# EAGLE design EasyRider (EAGLE 6.3)
EasyRider Motorcycle Telemetrics REV A
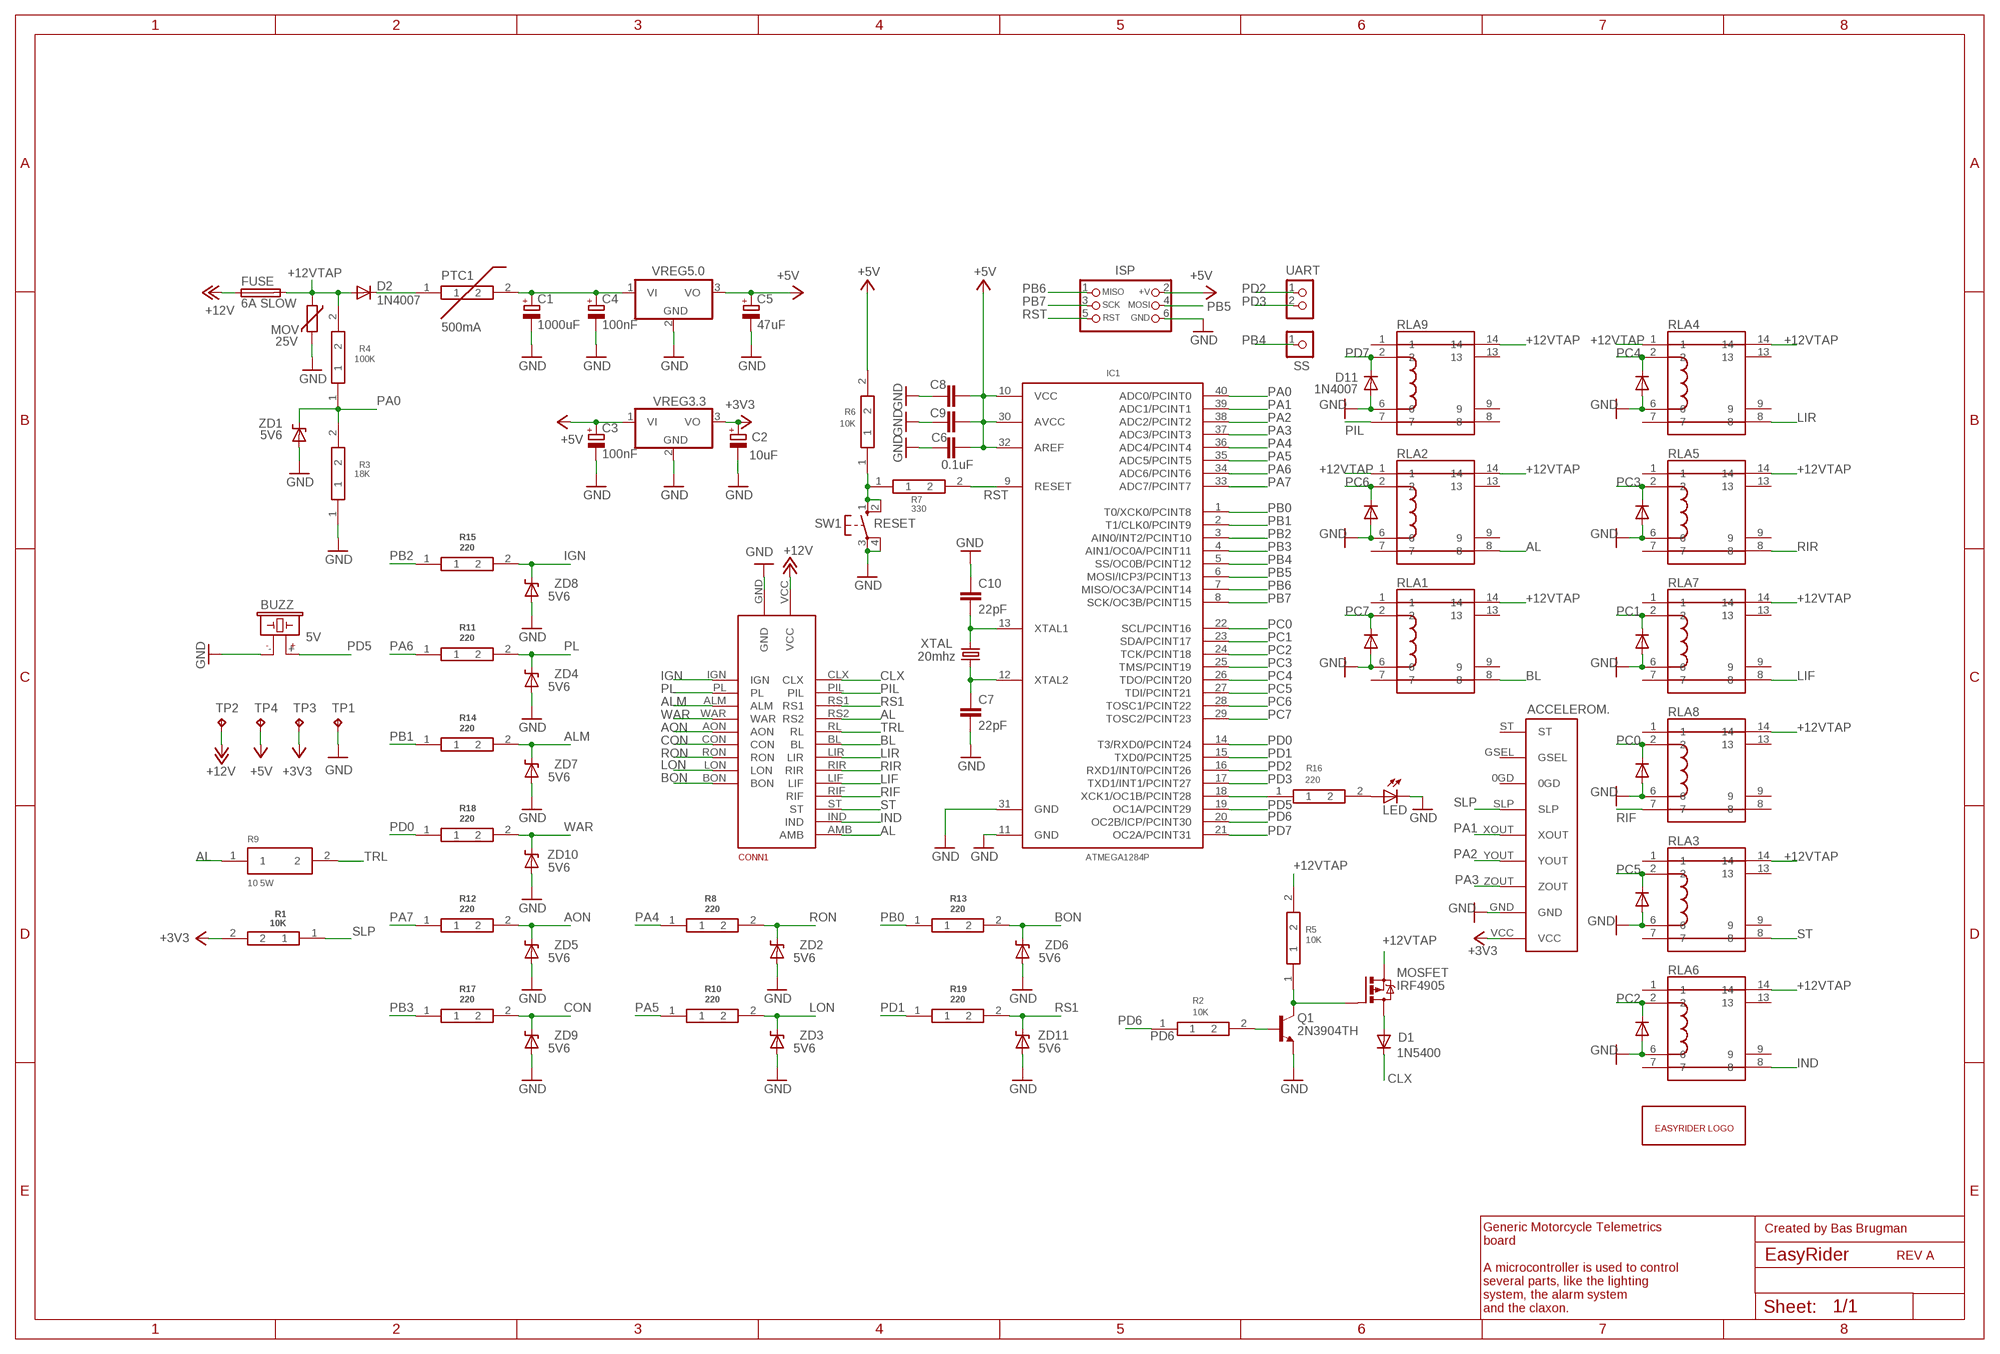
[diagram p0: schematic, sheet 1]

## Parts
ACCELEROM.  MMA7361FREESCALE  ACCELBOARDSIL  [BREAKOUT]
BUZZ  5V  BUZZERDIP  [0.3PITCH]
C1  1000uF  CAPACITOR_POL0.2PITCH  [E5-10,5]
C2  10uF  CAPACITOR_POL0.1PITCH4MMDIA  [E2,5-4R]
C3  100nF  CAPACITOR_POL0.1PITCH4MMDIA  [E2,5-4R]
C4  100nF  CAPACITOR_POL0.1PITCH4MMDIA  [E2,5-4R]
C5  47uF  CAPACITOR_POL0.1PITCH  [E2,5-7]
C6  0.1uF  CAPACITOR0.1PITCH  [C025-024X044]
C7  22pF  CAPACITOR0.1PITCH  [C025-024X044]
C8  0.1uF  CAPACITOR0.1PITCH  [C025-024X044]
C9  0.1uF  CAPACITOR0.1PITCH  [C025-024X044]
C10  22pF  CAPACITOR0.1PITCH  [C025-024X044]
CONN1  EASYRIDER_CONNDIP  [SIL]
D1  1N5400  1N5400DIP  [DO201-15]
D2  1N4007  1N4007DIP  [DIP_1N4007]
D3  1N4007DIP  [DIP_1N4007]
D4  1N4007DIP  [DIP_1N4007]
D5  1N4007DIP  [DIP_1N4007]
D6  1N4007DIP  [DIP_1N4007]
D7  1N4007DIP  [DIP_1N4007]
D8  1N4007DIP  [DIP_1N4007]
D9  1N4007DIP  [DIP_1N4007]
D10  1N4007DIP  [DIP_1N4007]
D11  1N4007  1N4007DIP  [DIP_1N4007]
FUSE  6A SLOW  FUSE_HOLDER_225DIP  [SH22,5A]
IC1  ATMEGA1284P  MEGA1284PDIP  [DIL40]
ISP  CON_HEADER_PRG_AVR_ICSP-PTH  [HEADER_PRG_2X03]
LED  LEDDIP  [LED3MM]
MOSFET  IRF4905  IRF4905TH  [TO220]
MOV  25V  VARISTORSIL  [R-5]
PTC1  500mA  PTCSMD  [PTC]
Q1  2N3904TH  [TO92]
R1  10K  RESISTOR_GENERICDIP  [RESISTOR]
R2  10K  RESISTOR_GENERICDIP  [RESISTOR]
R3  18K  RESISTOR_GENERICDIP  [RESISTOR]
R4  100K  RESISTOR_GENERICDIP  [RESISTOR]
R5  10K  RESISTOR_GENERICDIP  [RESISTOR]
R6  10K  RESISTOR_GENERICDIP  [RESISTOR]
R7  330  RESISTOR_GENERICDIP  [RESISTOR]
R8  220  RESISTOR_GENERICDIP  [RESISTOR]
R9  10 5W  RESISTOR_GENERIC_HIGH_WATTDIP  [RESISTOR]
R10  220  RESISTOR_GENERICDIP  [RESISTOR]
R11  220  RESISTOR_GENERICDIP  [RESISTOR]
R12  220  RESISTOR_GENERICDIP  [RESISTOR]
R13  220  RESISTOR_GENERICDIP  [RESISTOR]
R14  220  RESISTOR_GENERICDIP  [RESISTOR]
R15  220  RESISTOR_GENERICDIP  [RESISTOR]
R16  220  RESISTOR_GENERICDIP  [RESISTOR]
R17  220  RESISTOR_GENERICDIP  [RESISTOR]
R18  220  RESISTOR_GENERICDIP  [RESISTOR]
R19  220  RESISTOR_GENERICDIP  [RESISTOR]
RLA1  MEDER_REED_DIP05-1A72-12LDIP  [DIP05-1A72-12L]
RLA2  MEDER_REED_DIP05-1A72-12LDIP  [DIP05-1A72-12L]
RLA3  MEDER_REED_DIP05-1A72-12LDIP  [DIP05-1A72-12L]
RLA4  MEDER_REED_DIP05-1A72-12LDIP  [DIP05-1A72-12L]
RLA5  MEDER_REED_DIP05-1A72-12LDIP  [DIP05-1A72-12L]
RLA6  MEDER_REED_DIP05-1A72-12LDIP  [DIP05-1A72-12L]
RLA7  MEDER_REED_DIP05-1A72-12LDIP  [DIP05-1A72-12L]
RLA8  MEDER_REED_DIP05-1A72-12LDIP  [DIP05-1A72-12L]
RLA9  MEDER_REED_DIP05-1A72-12LDIP  [DIP05-1A72-12L]
SS  CON_HEADER_1X01-PTH  [M1X1]
SW1  RESET  10-XXDIP  [DIP45MM_56MM_PITCH]
TP1  TPTP20SQ  [TP20SQ]
TP2  TPTP20SQ  [TP20SQ]
TP3  TPTP20SQ  [TP20SQ]
TP4  TPTP20SQ  [TP20SQ]
U$1  EASYRIDER_LOGO  [EASYRIDER_LOGO]
UART  CON_HEADER_1X02-PTH  [M1X2]
VREG3.3  VREG_IGODIP  [TO220]
VREG5.0  VREG_IGODIP  [TO220]
XTAL  20mhz  CRYSTALDIP  [HC49/S]
ZD1  5V6  DIODE_ZENER_56DIP  [DIODE_ZENER_56]
ZD2  5V6  DIODE_ZENER_56DIP  [DIODE_ZENER_56]
ZD3  5V6  DIODE_ZENER_56DIP  [DIODE_ZENER_56]
ZD4  5V6  DIODE_ZENER_56DIP  [DIODE_ZENER_56]
ZD5  5V6  DIODE_ZENER_56DIP  [DIODE_ZENER_56]
ZD6  5V6  DIODE_ZENER_56DIP  [DIODE_ZENER_56]
ZD7  5V6  DIODE_ZENER_56DIP  [DIODE_ZENER_56]
ZD8  5V6  DIODE_ZENER_56DIP  [DIODE_ZENER_56]
ZD9  5V6  DIODE_ZENER_56DIP  [DIODE_ZENER_56]
ZD10  5V6  DIODE_ZENER_56DIP  [DIODE_ZENER_56]
ZD11  5V6  DIODE_ZENER_56DIP  [DIODE_ZENER_56]

## Nets
+3V3: ACCELEROM..VCC C2.+ R1.2 TP3.TP VREG3.3.3(VO)
+5V: C3.+ C5.+ C6.2 C8.2 C9.2 IC1.10(VCC) IC1.30(AVCC) IC1.32(AREF) ISP.2(+V) R6.2 TP4.TP VREG3.3.1(VI) VREG5.0.3(VO)
+12V [20mil_clearance]: CONN1.VCC FUSE.1 TP2.TP
+12VTAP [12mil_clearance]: D2.A FUSE.2 MOSFET.S MOV.1 R4.2 R5.2 RLA1.14 RLA2.1 RLA2.14 RLA3.14 RLA4.1 RLA4.14 RLA5.14 RLA6.14 RLA7.14 RLA8.14 RLA9.14
AL: CONN1.AMB CONN1.RS2 R9.1 RLA2.8
ALM: CONN1.ALM R14.2 ZD7.C
AON: CONN1.AON R12.2 ZD5.C
BL: CONN1.BL RLA1.8
BON: CONN1.BON R13.2 ZD6.C
CLX [20mil_clearance]: CONN1.CLX D1.C
CON: CONN1.CON R17.2 ZD9.C
GND: ACCELEROM..GND BUZZ.- C1.- C2.- C3.- C4.- C5.- C6.1 C7.2 C8.1 C9.1 C10.1 CONN1.GND D3.A D4.A D5.A D6.A D7.A D8.A D9.A D10.A D11.A IC1.11(GND) IC1.31(GND) ISP.6(GND) LED.K(C) MOV.2 Q1.3(E) R3.1 RLA1.6 RLA2.6 RLA3.6 RLA4.6 RLA5.6 RLA6.6 RLA7.6 RLA8.6 RLA9.6 SW1.3 SW1.4 TP1.TP VREG3.3.2(GND) VREG5.0.2(GND) ZD1.A ZD2.A ZD3.A ZD4.A ZD5.A ZD6.A ZD7.A ZD8.A ZD9.A ZD10.A ZD11.A
IGN: CONN1.IGN R15.2 ZD8.C
IND: CONN1.IND RLA6.8
LIF: CONN1.LIF RLA7.8
LIR: CONN1.LIR RLA4.8
LON: CONN1.LON R10.2 ZD3.C
N$1: C7.1 IC1.12(XTAL2) XTAL.1
N$2: C10.2 IC1.13(XTAL1) XTAL.2
N$4: R6.1 R7.1 SW1.1 SW1.2
N$5: IC1.18(XCK1/OC1B/PCINT28) R16.1
N$6: MOSFET.G Q1.1(C) R5.1
N$7 [20mil_clearance]: D1.A MOSFET.D
N$8: LED.A R16.2
N$25 [20mil_clearance]: C1.+ C4.+ PTC1.2 VREG5.0.1(VI)
N$26 [20mil_clearance]: D2.C PTC1.1
N$30: Q1.2(B) R2.2
PA0: IC1.40(ADC0/PCINT0) R3.2 R4.1 ZD1.C
PA1: ACCELEROM..XOUT IC1.39(ADC1/PCINT1)
PA2: ACCELEROM..YOUT IC1.38(ADC2/PCINT2)
PA3: ACCELEROM..ZOUT IC1.37(ADC3/PCINT3)
PA4: IC1.36(ADC4/PCINT4) R8.1
PA5: IC1.35(ADC5/PCINT5) R10.1
PA6: IC1.34(ADC6/PCINT6) R11.1
PA7: IC1.33(ADC7/PCINT7) R12.1
PB0: IC1.1(T0/XCK0/PCINT8) R13.1
PB1: IC1.2(T1/CLK0/PCINT9) R14.1
PB2: IC1.3(AIN0/INT2/PCINT10) R15.1
PB3: IC1.4(AIN1/OC0A/PCINT11) R17.1
PB4: IC1.5(SS/OC0B/PCINT12) SS.1
PB5: IC1.6(MOSI/ICP3/PCINT13) ISP.4(MOSI)
PB6: IC1.7(MISO/OC3A/PCINT14) ISP.1(MISO)
PB7: IC1.8(SCK/OC3B/PCINT15) ISP.3(SCK)
PC0: D10.C IC1.22(SCL/PCINT16) RLA8.2
PC1: D9.C IC1.23(SDA/PCINT17) RLA7.2
PC2: D8.C IC1.24(TCK/PCINT18) RLA6.2
PC3: D7.C IC1.25(TMS/PCINT19) RLA5.2
PC4: D6.C IC1.26(TDO/PCINT20) RLA4.2
PC5: D5.C IC1.27(TDI/PCINT21) RLA3.2
PC6: D4.C IC1.28(TOSC1/PCINT22) RLA2.2
PC7: D3.C IC1.29(TOSC2/PCINT23) RLA1.2
PD0: IC1.14(T3/RXD0/PCINT24) R18.1
PD1: IC1.15(TXD0/PCINT25) R19.1
PD2: IC1.16(RXD1/INT0/PCINT26) UART.1
PD3: IC1.17(TXD1/INT1/PCINT27) UART.2
PD5: BUZZ.+ IC1.19(OC1A/PCINT29)
PD6: IC1.20(OC2B/ICP/PCINT30) R2.1
PD7: D11.C IC1.21(OC2A/PCINT31) RLA9.2
PIL: CONN1.PIL RLA9.7
PL: CONN1.PL R11.2 ZD4.C
RIF: CONN1.RIF RLA8.7
RIR: CONN1.RIR RLA5.8
RON: CONN1.RON R8.2 ZD2.C
RS1: CONN1.RS1 R19.2 ZD11.C
RST: IC1.9(RESET) ISP.5(RST) R7.2
SLP: ACCELEROM..SLP R1.1
ST: CONN1.ST RLA3.8
TRL: CONN1.RL R9.2
WAR: CONN1.WAR R18.2 ZD10.C
Unconnected: ACCELEROM..0GD ACCELEROM..GSEL ACCELEROM..ST RLA1.1 RLA1.7 RLA1.9 RLA1.13 RLA2.7 RLA2.9 RLA2.13 RLA3.1 RLA3.7 RLA3.9 RLA3.13 RLA4.7 RLA4.9 RLA4.13 RLA5.1 RLA5.7 RLA5.9 RLA5.13 RLA6.1 RLA6.7 RLA6.9 RLA6.13 RLA7.1 RLA7.7 RLA7.9 RLA7.13 RLA8.1 RLA8.8 RLA8.9 RLA8.13 RLA9.1 RLA9.8 RLA9.9 RLA9.13

## Notes on the sheet
- Created by Bas Brugman
- REV A
- Generic Motorcycle Telemetrics
  board
  
  A microcontroller is used to control
  several parts, like the lighting
  system, the alarm system
  and the claxon.

## Library data of the parts
ACCELEROM. = accelboar_mma7361:ACCELBOARD
BUZZ = buzzer:BUZZER: Generic buzzer; OC_FARNELL: unknown; OC_NEWARK: unknown
C1-C5 = cap_pol:CAPACITOR_POL
C6-C10 = cap_ceramic:CAPACITOR
CONN1 = connector_easyrider:EASYRIDER_CONN
D1 = diode_1n5400:1N5400: DIODE standard rectifier, 3 A, 50 V (Motorola)
D2-D11 = diode_1n4007:1N4007: DIODE general purpose rectifier, 1 A
FUSE = fuseholder_5x20_225:FUSE_HOLDER_225: FUSE HOLDER grid 22,5mm, isolated cap OGN0031 8201, Schurter (Buerklin); MPN: 0031.7701.11; OC_FARNELL: unknown; OC_NEWARK: 04F1224
IC1 = atmel_avr_atmega1284p:MEGA1284P: Atmel ATmega1284P 8-bit AVR Microcontroller
ISP = isp_header:CON_HEADER_PRG_AVR_ICSP: 2x3 AVR ICSP programming header
LED = led:LED
MOSFET = mosfet_pnp:IRF4905: P-Channel HEXFET® Power MOSFET RDS(on)= 0.02 Ohm, ID = -74A Source: http://www.irf.com/product-info/datasheets/data/irf4905pbf.pdf
MOV = varistor:VARISTOR: 5mm pitch TH varistor
PTC1 = ptc_fuse_smd:PTC: PTC resettable fuse 500mA for 3.2mmx1.5mm package
Q1 = transistor_npn:2N3904: NPN Transistor
R1-R8 R10-R19 = resistor_generic_dip:RESISTOR_GENERIC
R9 = resistor_highwatt_dip:RESISTOR_GENERIC_HIGH_WATT: High watt cement resistor
RLA1-RLA9 = meder_reed_DIP05-1A72-12L:MEDER_REED_DIP05-1A72-12L: Meder Reed relay ic package 5V on coil, switching 15 watt
SS = connector_single:CON_HEADER_1X01
SW1 = button_momentary_6mm:10-XX: generic momentary button; MPN: B3F-1000; OC_FARNELL: 176432; OC_NEWARK: 36M3542
TP1-TP4 = testpad:TP: Test pad
U$1 = easyrider_logo:EASYRIDER_LOGO
UART = uart_header:CON_HEADER_1X02
VREG3.3 VREG5.0 = voltagereg_igo:VREG_IGO: Generic TO220 package for horizontal placed voltage regulators.
XTAL = crystal:CRYSTAL
ZD1-ZD11 = diode_zener_V56:DIODE_ZENER_56: Z DIODE 1.3 W

## Net classes
1 20mil_clearance: clearance 0.508 mm
2 12mil_clearance: clearance 0.305 mm

## Board
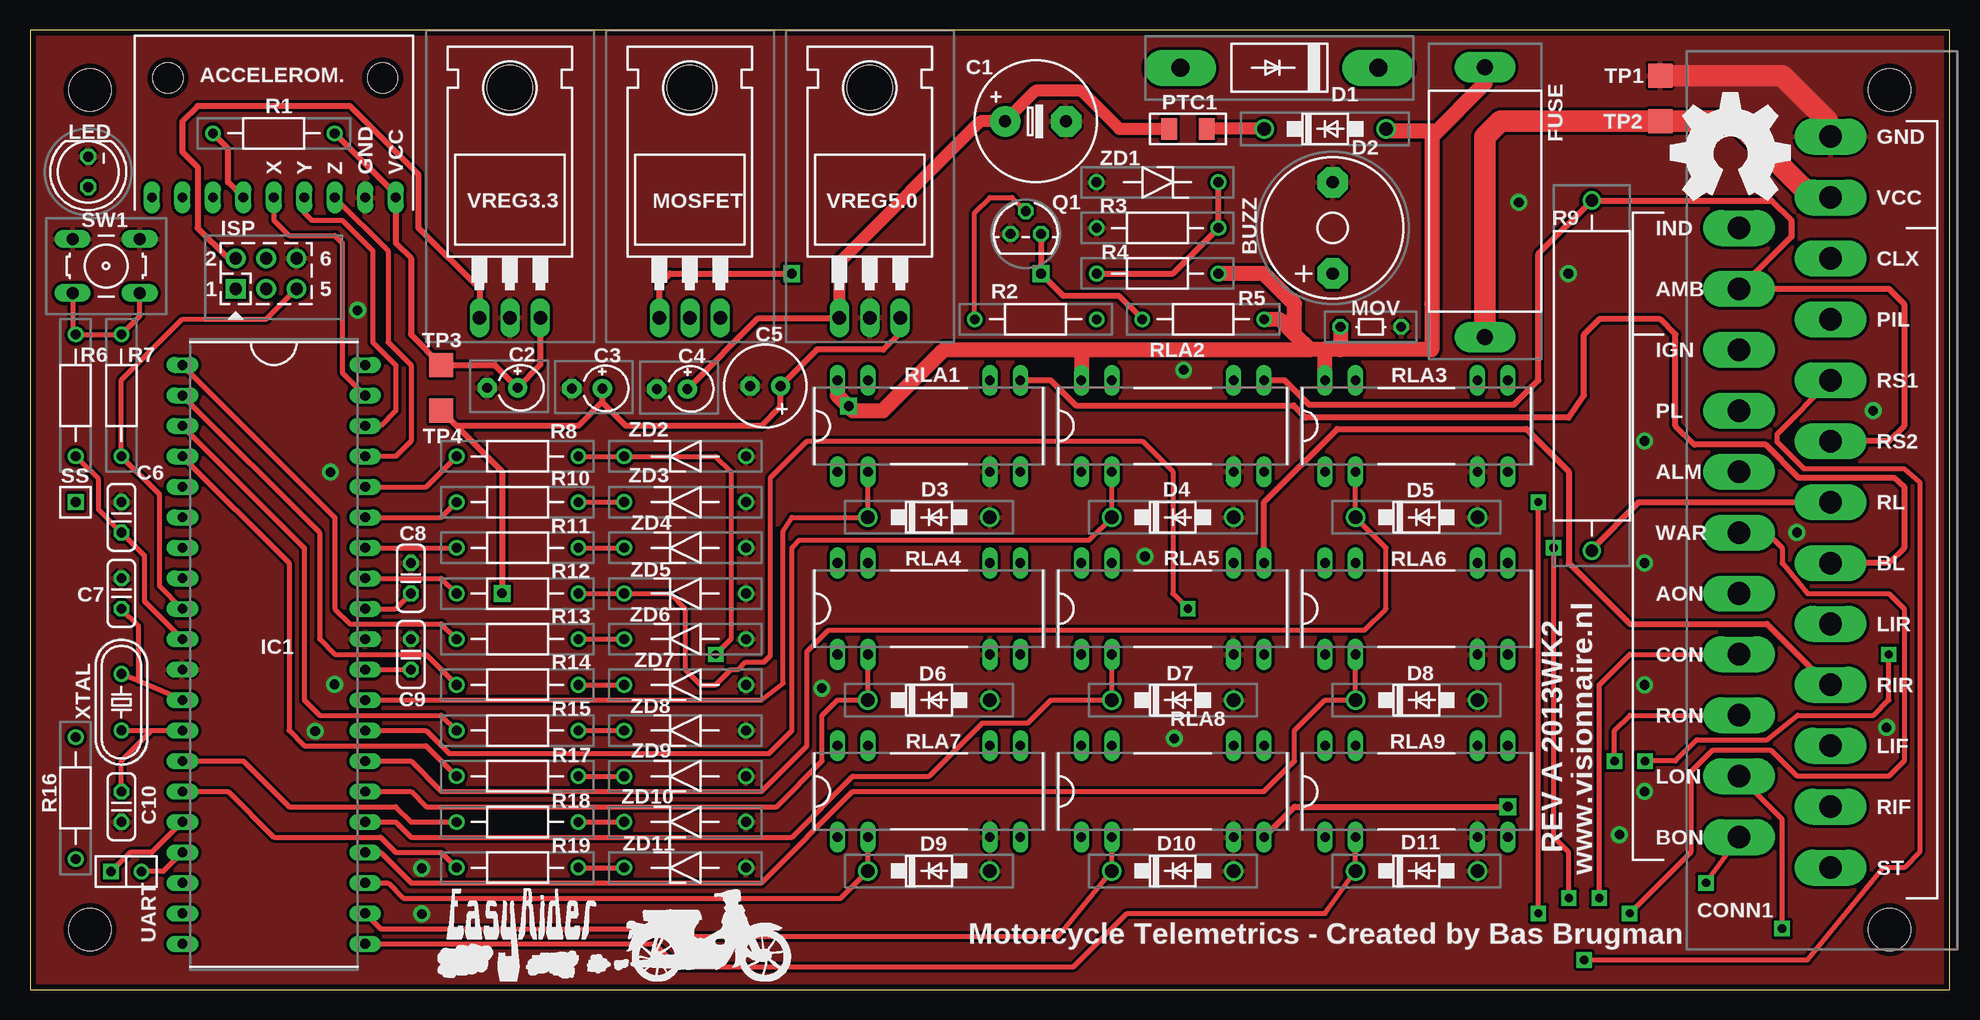
[diagram p1: board, top side]
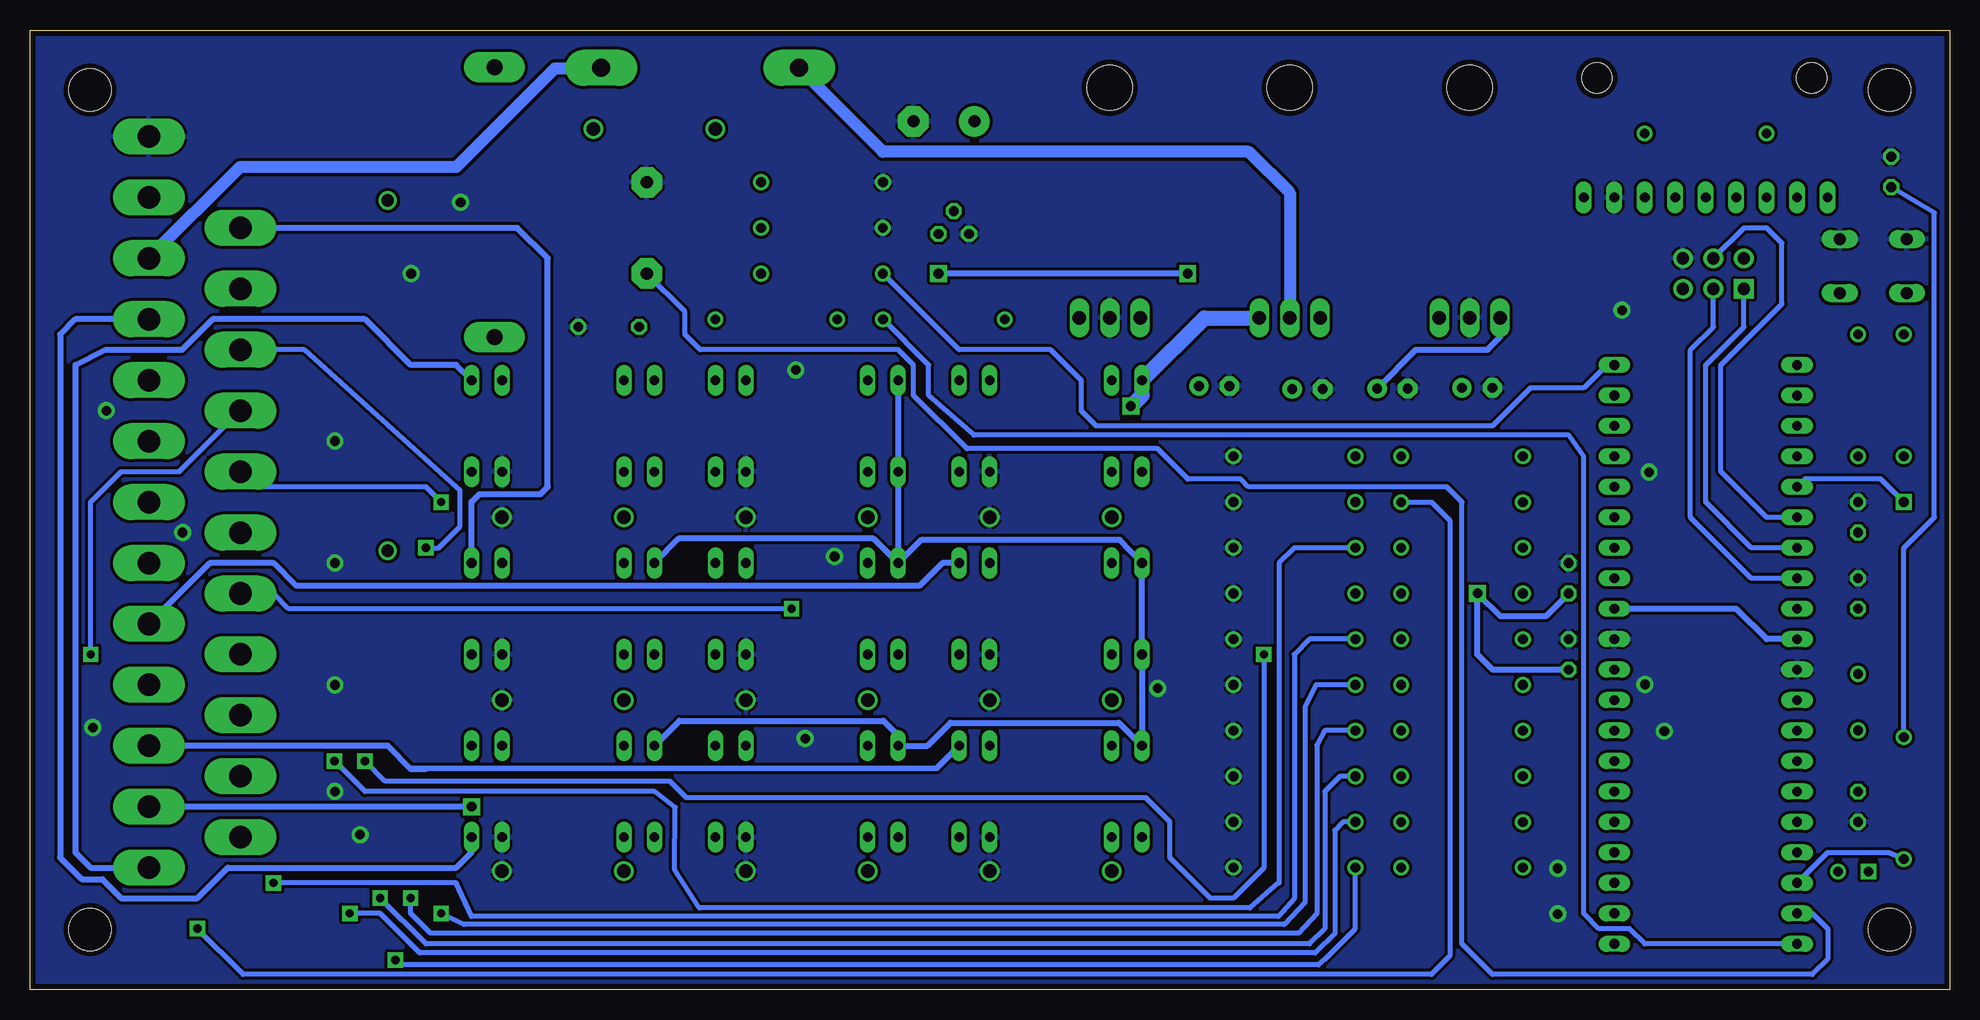
[diagram p2: board, bottom side, seen from below]

Size 160 x 80 mm. Coordinates in mm from the lower left corner, seen from the top.
Outline: 0,0 160,0 160,80 0,80 0,0
Copper layers (1*16): Top 0.018mm / dielectric 1.55mm / Bottom 0.018mm
Design rules "eC-STANDARD_pool-2-layer  *": minimum track width 0.15mm, minimum drill 0.25mm, track to track 10mil, track to pad 10mil, pad to pad 10mil, via to via 10mil, smd to smd 10mil, copper to edge 0.45mm, drill to drill 0.3mm, minimum pad ring 0.25mm, minimum via ring 0.3mm, stop-mask expansion 0.1mm, vias tented up to drill 0mil, thermal gap 0.2mm
Holes 3.5 mm at 5,5 5,75 155,75 155,5
Holes 2.5 mm at 29.4,76 11.5,76

### Footprints (pad centres in the part's own frame; a part is rotated, then mirrored left to right if it is on the bottom)
BREAKOUT = drill 0.813 long: 0GD 0,5.08; GND 0,-7.62; GSEL 0,7.62; SLP 0,2.54; ST 0,10.16; VCC 0,-10.16; XOUT 0,0; YOUT 0,-2.54; ZOUT 0,-5.08
0.3PITCH = drill 1.016 pad 2.54 octagon: + -3.81,0; - 3.81,0
E5-10,5 = drill 1.016 pad 2.54: + -2.54,0 | drill 1.016 pad 2.54 octagon: - 2.54,0
E2,5-4R = drill 0.813 pad 1.6: + -1.27,0 | drill 0.813 pad 1.6 octagon: - 1.27,0
E2,5-7 = drill 0.813 pad 1.6: + -1.27,0 | drill 0.813 pad 1.6 octagon: - 1.27,0
C025-024X044 = drill 0.813 octagon: 1 -1.27,0; 2 1.27,0
SIL = drill 1.88 pad 3 long: ALM -7.62,33.02; AMB -7.62,48.26; AON -7.62,22.86; BL 0,25.4; BON -7.62,2.54; CLX 0,50.8; CON -7.62,17.78; GND 0,60.96; IGN -7.62,43.18; IND -7.62,53.34; LIF 0,10.16; LIR 0,20.32; LON -7.62,7.62; PIL 0,45.72; PL -7.62,38.1; RIF 0,5.08; RIR 0,15.24; RL 0,30.48; RON -7.62,12.7; RS1 0,40.64; RS2 0,35.56; ST 0,0; VCC 0,55.88; WAR -7.62,27.94
DO201-15 = drill 1.499 pad 3 long: A -8.25,0; C 8.25,0
DIP_1N4007 = drill 1.118: A -5.08,0; C 5.08,0
SH22,5A = drill 1.321 pad 2.54 long: 1 -11,0; 2 11.5,0
DIL40 = drill 0.813 long: 1 -24.13,-7.62; 2 -21.59,-7.62; 3 -19.05,-7.62; 4 -16.51,-7.62; 5 -13.97,-7.62; 6 -11.43,-7.62; 7 -8.89,-7.62; 8 -6.35,-7.62; 9 -3.81,-7.62; 10 -1.27,-7.62; 11 1.27,-7.62; 12 3.81,-7.62; 13 6.35,-7.62; 14 8.89,-7.62; 15 11.43,-7.62; 16 13.97,-7.62; 17 16.51,-7.62; 18 19.05,-7.62; 19 21.59,-7.62; 20 24.13,-7.62; 21 24.13,7.62; 22 21.59,7.62; 23 19.05,7.62; 24 16.51,7.62; 25 13.97,7.62; 26 11.43,7.62; 27 8.89,7.62; 28 6.35,7.62; 29 3.81,7.62; 30 1.27,7.62; 31 -1.27,7.62; 32 -3.81,7.62; 33 -6.35,7.62; 34 -8.89,7.62; 35 -11.43,7.62; 36 -13.97,7.62; 37 -16.51,7.62; 38 -19.05,7.62; 39 -21.59,7.62; 40 -24.13,7.62
HEADER_PRG_2X03 = drill 1.02 pad 1.632 square: 1 -2.54,-1.27 | drill 1.02 pad 1.632: 2 -2.54,1.27; 3 0,-1.27; 4 0,1.27; 5 2.54,-1.27; 6 2.54,1.27
LED3MM = drill 0.813 octagon: A -1.27,0; K 1.27,0
TO220 = drill 1.118 long: D 0,-7.985; G -2.54,-7.985; S 2.54,-7.985 | hole 3.75: 0,11.176
R-5 = drill 0.813 octagon: 1 -2.54,0; 2 2.54,0
PTC = smd 1.3 x 1.8: 1 -1.55,0; 2 1.55,0
TO92 = drill 0.813 octagon: 1 1.27,0; 2 0,1.905; 3 -1.27,0
RESISTOR = drill 0.8: 1 -5.08,0; 2 5.08,0
RESISTOR' = drill 1.016: 1 -12.7,0; 2 16.51,0
DIP05-1A72-12L = drill 0.8 long: 1 -7.62,-3.81; 2 -5.08,-3.81; 6 5.08,-3.81; 7 7.62,-3.81; 8 7.62,3.81; 9 5.08,3.81; 13 -5.08,3.81; 14 -7.62,3.81
M1X1 = drill 0.813 square: 1 0,0
DIP45MM_56MM_PITCH = drill 1.016 long: 1 -2.8,2.25; 2 2.8,2.25; 3 -2.8,-2.25; 4 2.8,-2.25
TP20SQ = smd 2 x 2: TP 0,0
M1X2 = drill 0.8 square: 1 -1.27,0 | drill 0.8: 2 1.27,0
TO220' = drill 1.118 long: 1 -2.54,-7.985; 2 0,-7.985; 3 2.54,-7.985 | hole 3.75: 0,11.176
HC49/S = drill 0.813: 1 -2.36,0; 2 2.36,0
DIODE_ZENER_56 = drill 0.813: A -5.08,0; C 5.08,0

### Placement (x,y rotation side)
ACCELEROM.  20.32,66.04 90 top
BUZZ  108.58,63.5 90 top
C1  83.82,72.39 0 top
C2  39.37,50.16 180 top
C3  46.44,50.11 180 top
C4  53.53,50.07 180 top
C5  61.29,50.32 180 top
C6  7.62,39.37 270 top
C7  7.62,33.02 90 top
C8  31.75,34.29 270 top
C9  31.75,27.94 270 top
C10  7.62,15.24 90 top
CONN1  150.09,10.16 0 top
D1  104.14,76.83 0 top
D2  107.95,71.75 180 top
D3  74.93,39.37 180 top
D4  95.25,39.37 180 top
D5  115.57,39.37 180 top
D6  74.93,24.13 180 top
D7  95.25,24.13 180 top
D8  115.57,24.13 180 top
D9  74.93,9.89 180 top
D10  95.25,9.89 180 top
D11  115.57,9.89 180 top
FUSE  121.28,65.41 90 top
IC1  20.32,27.94 270 top
ISP  19.68,59.69 0 top
LED  4.86,68.17 90 top
MOSFET  55,64 0 top
MOV  111.76,55.24 0 top
PTC1  96.52,71.75 180 top
Q1  83,63 0 top
R1  20.32,71.39 0 top
R2  83.82,55.88 180 top
R3  93.98,63.5 0 top
R4  93.98,59.69 0 top
R5  97.79,55.88 0 top
R6  3.81,49.53 270 top
R7  7.62,49.53 270 top
R8  40.64,44.45 0 top
R9  10 5W  [RESISTOR']  130.18,53.09 270 top
R10  40.64,40.64 0 top
R11  40.64,36.83 0 top
R12  40.64,33.02 0 top
R13  40.64,29.21 0 top
R14  40.64,25.4 0 top
R15  40.64,21.59 0 top
R16  3.81,15.97 90 top
R17  40.64,17.78 0 top
R18  40.64,13.97 0 top
R19  40.64,10.16 0 top
RLA1  74.93,46.99 0 top
RLA2  95.25,46.99 0 top
RLA3  115.57,46.99 0 top
RLA4  74.93,31.75 0 top
RLA5  95.25,31.75 0 top
RLA6  115.57,31.75 0 top
RLA7  74.93,16.51 0 top
RLA8  95.25,16.51 0 top
RLA9  115.57,16.51 0 top
SS  3.81,40.64 0 top
SW1  6.35,60.33 180 top
TP1  135.89,76.2 0 top
TP2  135.89,72.39 0 top
TP3  34.29,52.07 0 top
TP4  34.29,48.26 0 top
U$1  33.08,0.64 0 top
U$2  [OSHW_FILLX350_NOTEXT]  136.79,65.85 0 top
UART  8.03,9.84 0 top
VREG3.3  [TO220']  40,64 0 top
VREG5.0  [TO220']  70,64 0 top
XTAL  7.62,23.96 270 top
ZD1  93.98,67.31 0 top
ZD2  54.61,44.45 180 top
ZD3  54.61,40.64 180 top
ZD4  54.61,36.83 180 top
ZD5  54.61,33.02 180 top
ZD6  54.61,29.21 180 top
ZD7  54.61,25.4 180 top
ZD8  54.61,21.59 180 top
ZD9  54.61,17.78 180 top
ZD10  54.61,13.97 180 top
ZD11  54.61,10.16 180 top

### Tracks (layer width: path | path; a pad name or v marks a point on that pad's centre or on a via)
+3V3
  Top 0.508: R1.2 30.48,66.31 ACCELEROM..VCC 30.48,62.23 31.75,60.96 31.75,54.61 TP3.TP 38.73,52.07 C2.+ 42.54,52.06 VREG3.3.3
+5V  (via drill 0.81)
  Top 0.406: IC1.10 9.53,32.38 9.53,36.2 C6.2 5.71,40.01 5.71,42.55 R6.2 | IC1.30 C9.2 | IC1.32 30.48,31.75 C8.2
  Top 0.508: 35.56,46.99 45.72,46.99 47.71,48.98 | 35.56,46.99 TP4.TP | ISP.2 16.51,60.96 13.97,63.5 13.97,68.58 12.7,69.85 12.7,72.39 13.97,73.66 26.67,73.66 32.38,67.94 32.38,63.5 37.47,58.42 VREG3.3.1 | 35.56,46.99 39.37,43.18 v39.34,33.04 | C3.+ 47.71,48.98 | 47.71,48.98 49.69,46.99 60.96,46.99 62.58,48.61 62.58,50.3 C5.+ 65.53,53.29 65.53,53.34 71.12,53.34 72.64,54.86 72.64,55.91 VREG5.0.3
  Bottom 0.508: C8.2 33.66,31.11 37.41,31.11 v39.34,33.04 39.37,33.01 39.37,27.94 38.1,26.67 C9.2 | IC1.10 15.24,29.21 17.78,31.75 IC1.32 | VREG3.3.1 37.46,54.4 38.52,53.34 44.48,53.34 C3.+
+12V
  Top 1.778: CONN1.VCC 148.59,66.04 142.24,72.39 TP2.TP 122.56,72.39 121.28,71.12 FUSE.1
+12VTAP  (via drill 0.81)
  Top 1.27: 116.85,71.12 116.85,71.58 113.21,71.58 D2.A | 116.85,71.12 116.84,57.15 116.84,53.34 109.22,53.34 | 109.22,53.34 107.95,53.34 | 107.95,53.34 106.68,53.34 | 106.68,53.34 105.41,54.61 | 105.41,54.61 105.41,57.15 102.87,59.69 R4.2 | RLA3.14 107.95,53.34 | R5.2 104.14,55.88 105.41,54.61 | RLA1.14 67.31,49.53 68.58,48.26 71.12,48.26 76.2,53.34 87.63,53.34 | FUSE.2 121.28,75.55 116.85,71.12 | MOV.1 109.22,53.34 | 87.63,53.34 106.68,53.34 | 87.63,53.34 RLA2.14
  Bottom 0.508: RLA5.14 87.66,35.56 89.69,37.59 105.92,37.59 RLA6.14 | RLA9.14 105.86,22.41 88.86,22.41 87.63,21.18 RLA8.14 85.21,20.32 83.28,22.24 69.23,22.24 RLA7.14 RLA4.1 RLA4.14 69.19,37.52 85.67,37.52 RLA5.14 | RLA2.14 RLA2.1 RLA5.14
  Bottom 0.762: 57.55,56 MOSFET.S
  Bottom 1.27: 57.55,56 62.11,56 RLA1.14 67.31,49.53 68.2,48.64 v68.25,48.64
AL
  Top 0.508: RLA2.8 104.57,50.8 106.61,48.76 123.69,48.76 125.73,50.8 125.73,61.34 R9.1 145.16,65.79 146.82,64.13 146.82,62.76 CONN1.AMB 154.94,58.42 156.21,57.15 156.21,46.99 154.94,45.72 CONN1.RS2
ALM  (via drill 0.69)
  Top 0.406: R14.2 ZD7.C | v125.73,6.35 v125.73,40.64
  Bottom 0.406: ZD7.C 52.79,25.4 53.72,23.51 53.72,7.27 55.45,5.44 123.85,5.44 v125.73,6.35 | v125.73,40.64 127,41.91 141.21,41.91 CONN1.ALM
AON  (via drill 0.69)
  Top 0.406: R12.2 ZD5.C 53.34,33.02 54.61,31.75 54.61,26.67 55.88,25.4 57.15,25.4 58.42,26.67 59.04,26.67 59.67,27.29 61.18,27.29 61.73,27.84 61.73,42.68 64.77,45.72 92.71,45.72 95.25,43.18 95.25,33.02 v96.52,31.75
  Bottom 0.406: v96.52,31.75 138.43,31.75 139.7,33.02 CONN1.AON
BL
  Top 0.508: RLA1.8 85.07,50.8 87.18,48.69 105.31,48.69 106.33,47.68 128.25,47.68 129.54,49.53 129.54,54.61 130.81,55.88 135.89,55.88 137.16,54.61 137.16,46.99 138.73,45.42 144.67,45.42 147.41,42.68 155.37,42.68 156.21,41.91 156.21,36.83 154.94,35.56 CONN1.BL
BON  (via drill 0.69)
  Top 0.406: R13.2 ZD6.C | v139.7,8.89 CONN1.BON
  Bottom 0.406: ZD6.C 53.34,29.21 54.61,27.94 54.61,7.6 55.94,6.1 123.19,6.1 124.46,8.89 v139.7,8.89
CLX
  Bottom 1.016: D1.C 112.42,76.8 116.24,76.8 124.46,68.58 142.47,68.58 CONN1.CLX
CON  (via drill 0.69)
  Top 0.406: R17.2 ZD9.C | v130.81,7.62 130.81,25.4 133.35,27.94 CONN1.CON
  Bottom 0.406: ZD9.C 50.8,17.78 52.07,16.51 52.07,5.08 53.34,3.81 127,3.81 v130.81,7.62
GND  (via drill 0.81)
  Top 1.778: TP1.TP 146.05,76.2 149.86,72.39 149.86,71.36 CONN1.GND
  other vias: 132.49,12.91 134.58,16.51 134.58,25.4 134.58,35.56 134.58,45.72 147.28,38.1 128.23,59.69 153.63,48.26 154.76,21.84 95.38,20.92 66,25.12 25.38,25.43 23.77,21.54 27.29,56.63 124.11,65.63 96.17,51.66 32.66,10.11 25.04,43.13 32.66,6.3 92.93,36.11
  pour Top: -1.27,81.28 162.56,81.28 162.56,-1.27 -1.27,-1.27
  pour Bottom: -1.27,81.28 162.56,81.28 162.56,-1.27 -1.27,-1.27
IGN  (via drill 0.69)
  Top 0.406: R15.2 ZD8.C | v128.27,7.62 128.27,11.43 127,12.7 v127,36.83
  Bottom 0.406: ZD8.C 52.07,21.59 52.74,20.37 52.74,6.35 54.27,4.7 126.62,4.7 128.27,6.35 v128.27,7.62 | v127,36.83 125.94,36.83 124.16,38.61 124.16,41.61 124.46,41.91 137.16,53.34 CONN1.IGN
IND
  Bottom 0.508: RLA6.8 123.19,40.65 122.54,41.3 117.45,41.3 116.84,41.91 116.84,60.96 119.38,63.5 CONN1.IND
LIF
  Bottom 0.508: RLA7.8 84.43,18.44 128.27,18.39 | 128.27,18.39 127.06,18.39 | CONN1.LIF 130.15,20.32 128.27,18.39
LIR
  Bottom 0.508: RLA4.8 83.95,35.56 85.86,33.65 137.79,33.65 139.7,35.56 145.01,35.56 CONN1.LIR
LON  (via drill 0.69)
  Top 0.406: R10.2 ZD3.C | v146.05,5.08 146.05,14.21 CONN1.LON
  Bottom 0.406: R10.2 43.18,40.64 41.66,39.12 41.66,2.79 43.18,1.27 142.24,1.27 v146.05,5.08
N$1
  Top 0.406: IC1.12 9.02,25.71 | 9.02,25.71 XTAL.1 | C7.1 9.02,30.35 9.02,25.71
N$2
  Top 0.406: XTAL.2 10.16,21.6 | 10.16,21.6 IC1.13 | C10.2 7.62,19.06 10.16,21.6
N$4
  Top 0.406: SW1.2 3.55,54.87 R6.1 R7.1 9.16,56.15 SW1.1
N$5
  Bottom 0.406: IC1.18 10.16,11.43 5.08,11.43 R16.1
N$6  (via drill 0.81)
  Top 0.508: R5.1 90.74,57.85 86.12,57.85 v84.27,59.7 Q1.1 | v63.5,59.69 53.34,59.69 52.43,58.78 52.43,56.05 MOSFET.G
  Bottom 0.508: v63.5,59.69 v84.26,59.69 v84.27,59.7
N$7
  Bottom 1.016: MOSFET.D 54.99,66.42 58.42,69.85 88.91,69.85 88.92,69.86 | 88.92,69.85 88.92,69.86 | 88.92,69.86 D1.A
N$8
  Bottom 0.406: R16.2 3.81,36.83 1.27,39.37 1.27,64.77 LED.A
N$25
  Top 0.508: C4.+ 60.7,55.98 67.42,55.98 VREG5.0.1 67.44,56.04
  Top 1.016: 67.44,56.04 67.44,60.62 79.21,72.39 C1.+ 83.82,74.93 87.63,74.93 90.81,71.75 PTC1.2
N$26
  Top 1.016: D2.C PTC1.1
N$30
  Top 0.406: R2.2 78.74,64.77 80.01,66.04 81.87,66.04 81.87,66.03 Q1.2
PA0
  Top 0.508: R4.1 95.25,59.69 R3.2 ZD1.C
  Bottom 0.406: IC1.40 28.57,52.07 30.48,50.16 34.92,50.16 38.1,46.99 71.12,46.99 72.39,48.26 72.39,50.8 74.93,53.34 82.55,53.34 R4.1
PA1
  Top 0.406: ACCELEROM..XOUT 20.32,64.14 21.59,62.87 25.4,62.87 26.04,62.23 26.04,51.44 IC1.39
PA2
  Top 0.406: IC1.38 29.21,46.99 30.48,48.26 30.48,52.07 28.57,53.98 28.57,61.59 26.04,64.14 23.5,64.14 22.86,64.77 ACCELEROM..YOUT
PA3
  Top 0.406: ACCELEROM..ZOUT 29.84,61.59 29.84,53.98 31.75,52.07 31.75,45.72 30.48,44.45 IC1.37
PA4
  Top 0.406: IC1.36 33.02,41.91 R8.1
PA5
  Top 0.406: IC1.35 34.29,39.37 R10.1
PA6
  Top 0.406: IC1.34 R11.1
PA7
  Top 0.406: IC1.33 34.29,34.29 R12.1
PB0
  Top 0.406: IC1.1 25.4,39.37 25.4,31.75 26.67,30.48 34.29,30.48 R13.1
PB1
  Top 0.406: IC1.2 24.13,38.1 24.13,29.21 25.4,27.94 33.02,27.94 R14.1
PB2
  Top 0.406: IC1.3 22.86,36.83 22.86,24.13 24.13,22.86 34.29,22.86 R15.1
PB3
  Top 0.406: IC1.4 21.59,35.56 21.59,21.59 22.86,20.32 33.02,20.32 R17.1
PB4
  Bottom 0.406: SS.1 5.71,42.55 12.06,42.55 IC1.5
PB5
  Bottom 0.406: IC1.6 15.24,39.37 19.05,43.18 19.05,52.07 13.97,57.15 13.97,62.23 15.24,63.5 17.14,63.5 ISP.4
PB6
  Bottom 0.406: IC1.7 16.51,36.83 20.32,40.64 20.32,52.07 17.14,55.24 ISP.1
PB7
  Bottom 0.406: IC1.8 16.51,34.29 21.59,39.37 21.59,53.34 19.68,55.24 ISP.3
PC0
  Top 0.406: IC1.22 29.21,5.08 53.34,5.08 53.98,4.45 85.72,4.45 D10.C RLA8.2
PC1
  Top 0.406: IC1.23 29.84,8.89 31.11,7.62 67.58,7.62 D9.C RLA7.2
PC2
  Top 0.406: IC1.24 29.21,11.43 31.75,8.89 60.96,8.89 68.58,16.51 102.87,16.51 105.41,19.05 105.41,21.59 107.95,24.13 D8.C RLA6.2
PC3
  Top 0.406: IC1.25 30.48,13.97 31.75,12.7 63.5,12.7 68.58,17.78 74.93,17.78 79.38,22.23 83.19,22.23 85.09,24.13 D7.C RLA5.2
PC4
  Top 0.406: RLA4.2 D6.C 67.31,24.13 66.04,22.86 66.04,19.05 62.23,15.24 33.02,15.24 31.75,16.51 IC1.26
PC5
  Top 0.406: IC1.27 31.75,19.05 34.29,16.51 60.96,16.51 64.77,20.32 64.77,28.17 66.56,29.97 111.25,29.97 113.03,31.75 113.03,36.83 D5.C RLA3.2
PC6
  Top 0.406: IC1.28 33.02,21.59 34.92,19.68 61.59,19.68 63.5,21.59 63.5,36.83 64.14,37.47 88.27,37.47 D4.C RLA2.2
PC7
  Top 0.406: IC1.29 60.96,24.13 62.78,25.52 62.78,38.22 63.5,39.37 D3.C RLA1.2
PD0
  Top 0.406: IC1.14 17.78,19.05 21.59,15.24 30.48,15.24 31.75,13.97 R18.1
PD1
  Top 0.406: IC1.15 16.51,16.51 20.32,12.7 29.21,12.7 30.48,11.43 34.29,11.43 R19.1
PD2
  Top 0.406: IC1.16 10.16,11.43 8.36,11.43 UART.1
PD3
  Top 0.406: IC1.17 11.11,9.84 UART.2
PD5
  Bottom 0.406: IC1.19 11.43,6.35 10.16,5.08 10.16,2.54 11.43,1.27 38.1,1.27 40.64,3.81 40.64,40.64 41.91,41.91 58.42,41.91 59.05,42.55 63.5,42.55 66.04,45.09 81.92,45.09 86.36,49.53 86.36,52.07 87.63,53.34 104.14,53.34 105.41,54.61 105.41,56.52 BUZZ.+
PD6
  Bottom 0.406: R2.1 85.09,52.07 85.09,49.53 81.31,46.23 31.75,46.23 30.48,44.45 30.48,6.35 29.21,5.08 26.67,5.08 25.4,3.81 IC1.20
PD7
  Top 0.406: IC1.21 52.07,3.81 53.98,1.91 87,1.91 91.44,6.35 107.95,6.35 D11.C RLA9.2
PIL
  Bottom 0.508: CONN1.PIL 156.21,55.88 157.48,54.61 157.48,11 155.68,9.2 153.98,9.2 152.4,7.62 146.05,7.62 143.51,10.16 124.46,10.16 123.19,11.43 RLA9.7
PL  (via drill 0.69)
  Top 0.406: R11.2 ZD4.C | v154.94,27.94 154.94,24.13 153.67,22.86 147.32,22.86 144.78,20.83 138.94,20.83 137.16,19.05 v134.62,19.05
  Bottom 0.406: ZD4.C 54.61,36.83 55.88,35.56 55.88,8.89 55.94,8.89 58.3,6.81 104.21,6.81 106.25,9.99 106.22,15.2 107.95,16.51 132.08,16.51 v134.62,19.05 | v154.94,27.94 154.94,40.64 152.4,43.18 147.56,43.18 CONN1.PL
RIF  (via drill 0.81)
  Top 0.508: RLA8.7 105.41,15.24 v123.19,15.24
  Bottom 0.508: v123.19,15.24 CONN1.RIF
RIR
  Top 0.508: RLA5.8 102.87,40.63 108.97,46.73 124.72,46.73 128.27,43.18 128.27,35.56 133.35,30.48 144.78,30.48 149.86,25.4 CONN1.RIR
RON  (via drill 0.69)
  Top 0.406: R8.2 ZD2.C 57.15,44.45 58.42,43.18 58.42,29.21 v57.15,27.94 | v132.08,19.05 132.08,21.59 133.35,22.86 CONN1.RON
  Bottom 0.406: v57.15,27.94 57.15,10.16 59.69,7.62 61.62,7.62 65,11 65,14 67,16 105.29,16 106.65,17.36 130.4,17.36 v132.08,19.05
RS1  (via drill 0.69)
  Top 0.406: R19.2 ZD11.C | v129.54,2.46 148.15,2.46 154.42,10.16 156.21,10.16 157.52,11.47 157.52,42.31 156.21,43.42 147.85,43.42 145.63,45.64 145.63,46.33 CONN1.RS1
  Bottom 0.406: ZD11.C 49.53,5.08 52.07,2.54 52.58,2.06 129.06,2.06 v129.54,2.46
RST
  Top 0.406: IC1.9 10.79,33.66 10.79,41.27 R7.2 7.62,50.8 12.7,55.88 19.68,55.88 ISP.5
SLP
  Top 0.508: ACCELEROM..SLP 16.51,67.31 16.51,70.12 R1.1
ST
  Bottom 0.508: CONN1.ST 154.94,10.16 156.21,11.43 156.21,52.07 153.67,53.34 147.32,53.34 144.78,55.88 132.08,55.88 128.27,52.07 124.46,52.07 RLA3.8
TRL
  Top 0.508: CONN1.RL 134.11,40.64 130.18,36.7 R9.2
WAR  (via drill 0.69)
  Top 0.406: R18.2 ZD10.C | CONN1.WAR 144.78,38.1 146.05,36.83 146.05,35.56 148.15,33.02 154.94,33.02 156.21,31.75 156.21,19.05 154.94,17.78 147.32,17.78 145.36,19.71 145.1,19.97 140.26,19.97 138.43,18.14 138.43,11.43 v133.35,6.35
  Bottom 0.406: ZD10.C 50.56,13.97 51.25,13.28 51.25,4.66 52.87,3.04 127.5,3.04 130.81,6.35 v133.35,6.35

### Text on the board
tPlace: REV A 2013WK2 | www.visionnaire.nl | Motorcycle Telemetrics - Created by Bas Brugman